# EasyEDA Pro project 3轴5.2_ -0718 -(8.8x13cm).eprj, board 3轴5.2-PCB-V3.4
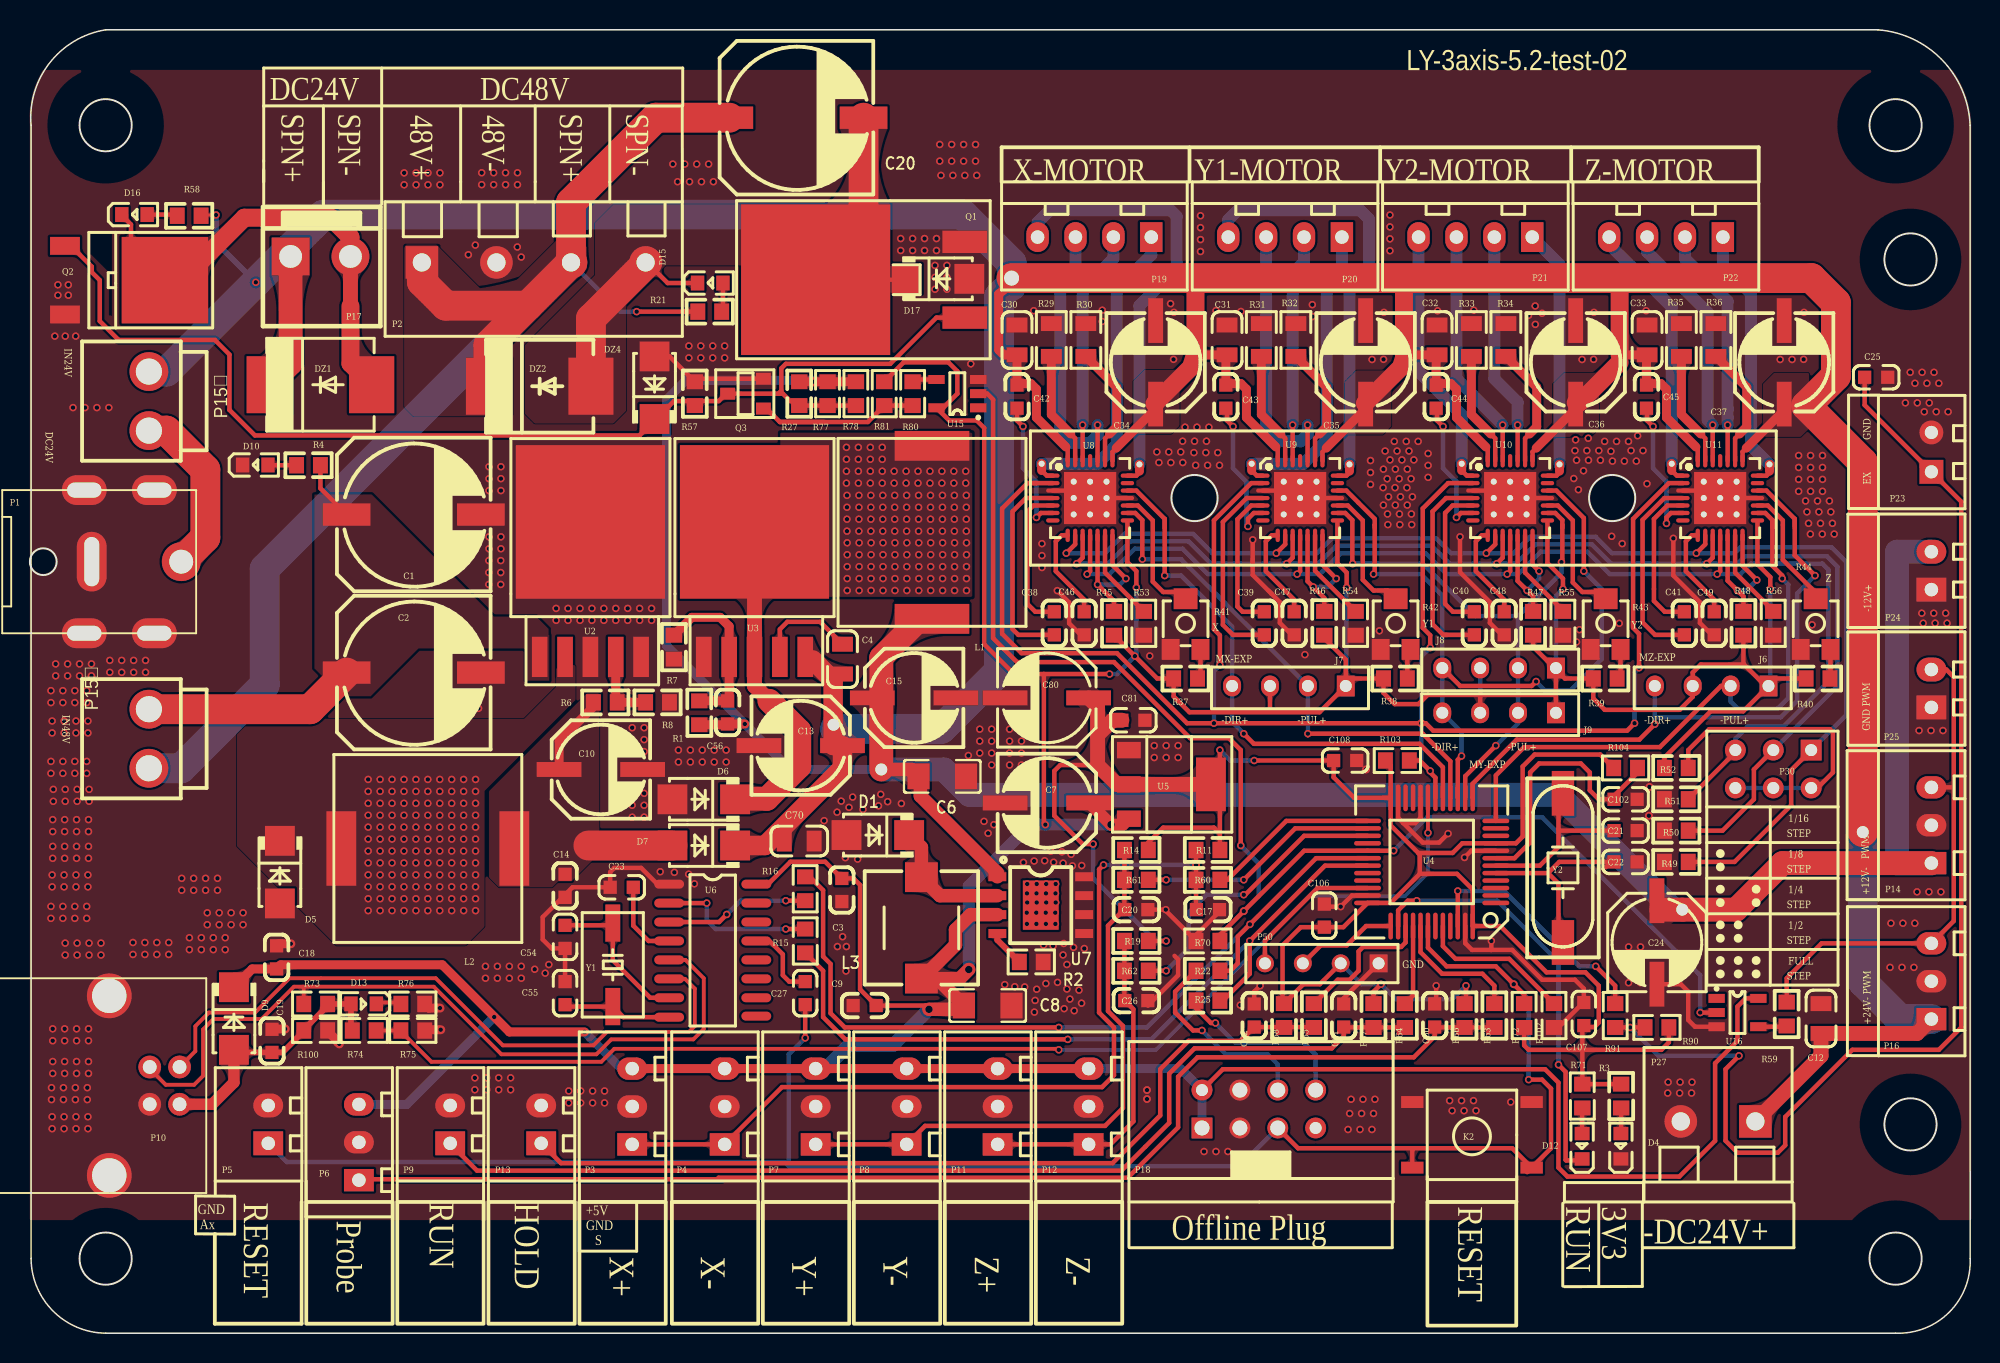
[diagram p2: board, top side]
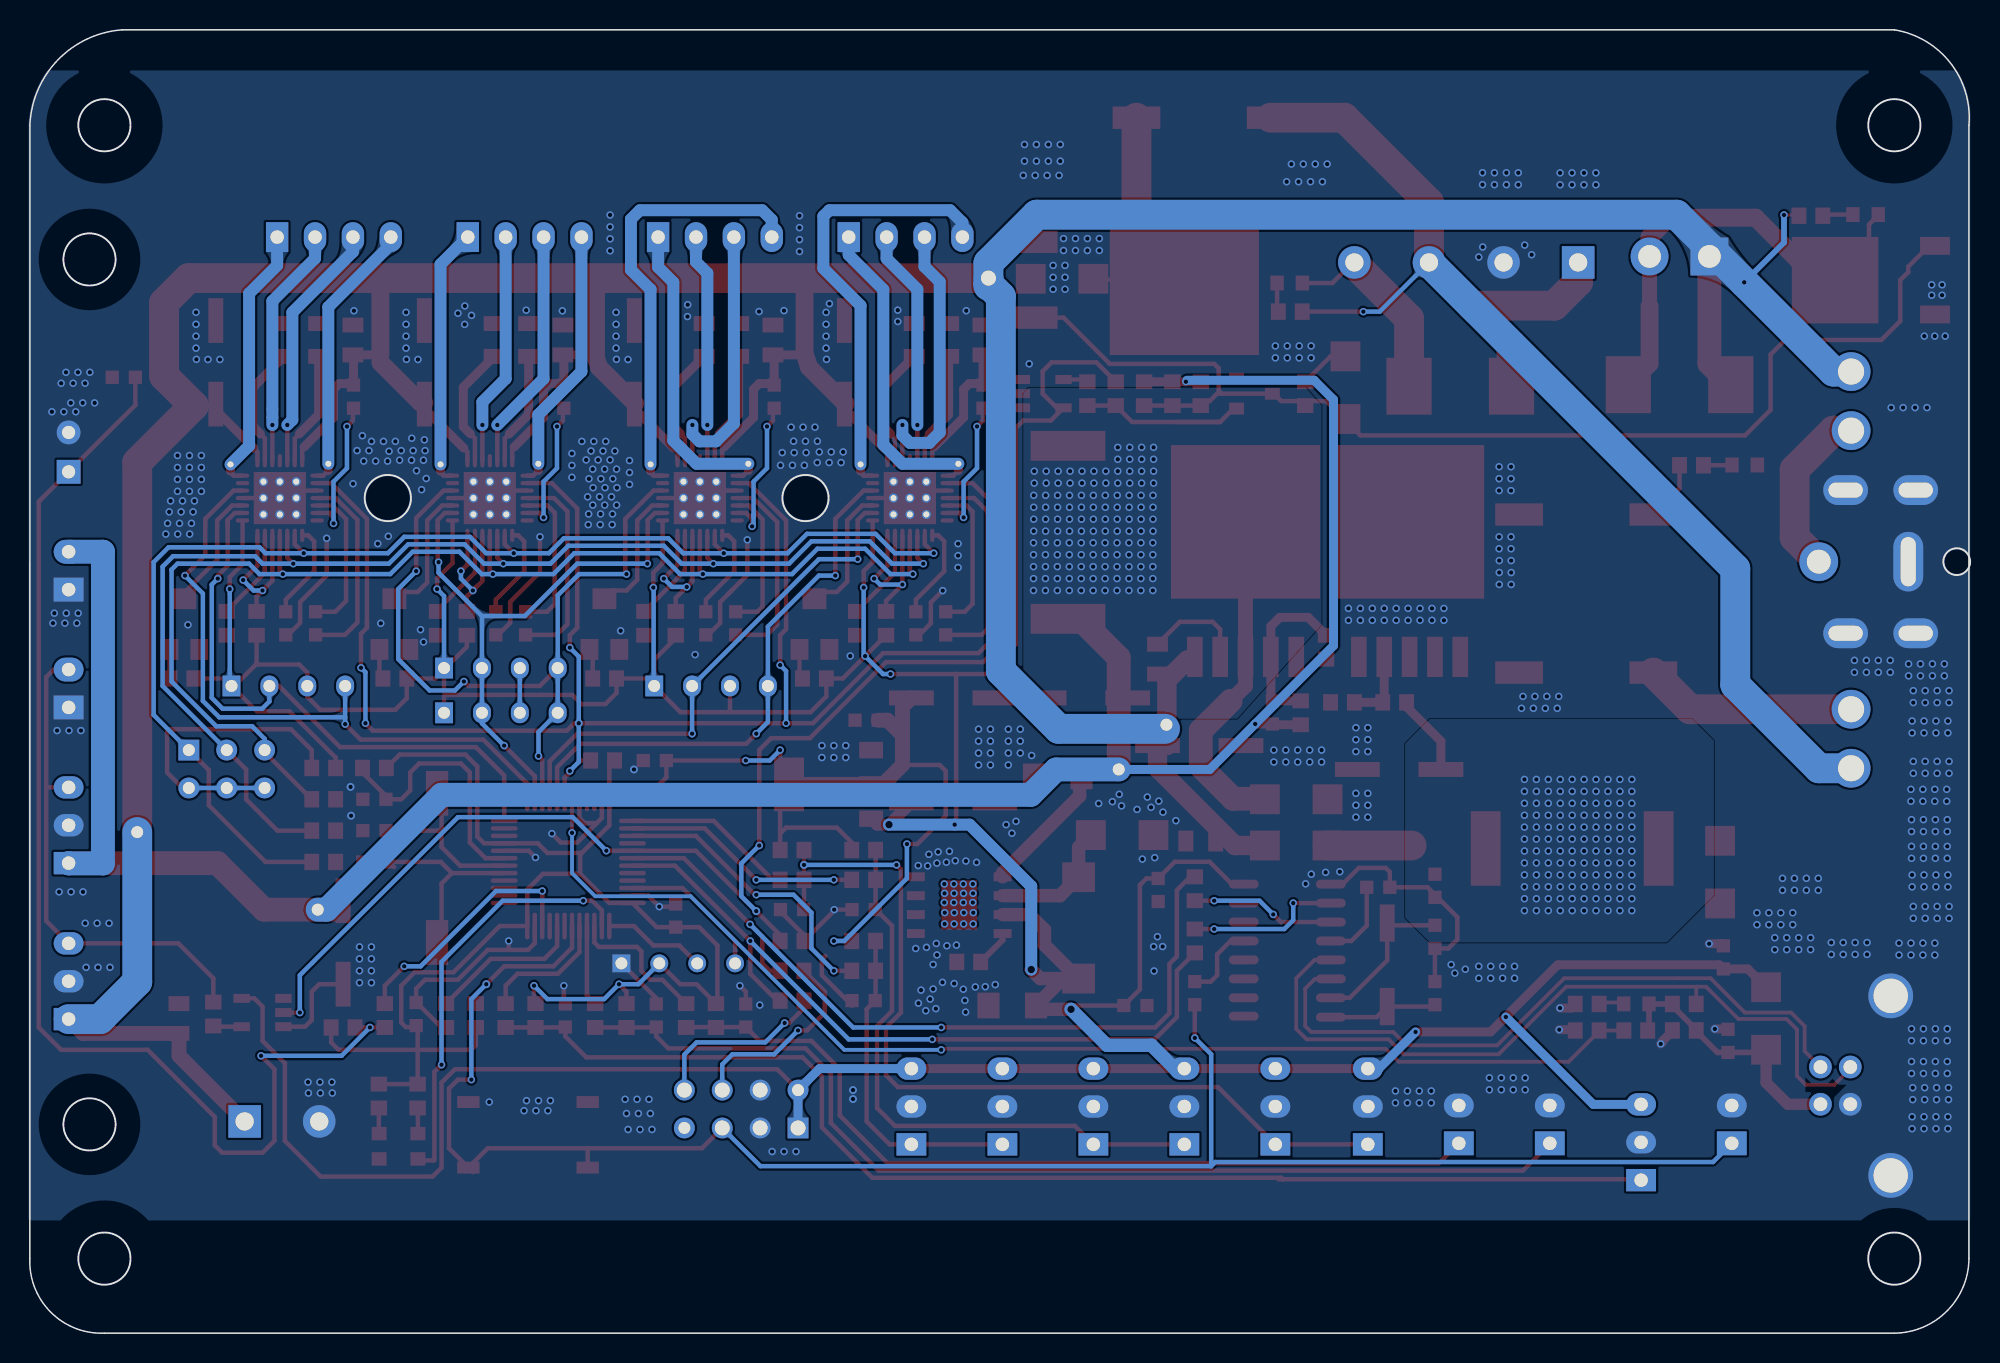
[diagram p3: board, bottom side, seen from below]

Outline 130.08 x 87.4 mm; copper layers: Top Layer, Bottom Layer. Coordinates in mm from the lower left corner of the outline.
Outline path: circle c5.08,81 r1.75 ; circle c5.08,5 r1.75 ; circle c78.08,56 r1.55 ; circle c106.08,56 r1.55 ; circle c125.08,81 r1.75 ; circle c125.08,5 r1.75 ; circle c126.08,72 r1.75 ; circle c126.08,14 r1.75 ; 0.08,81 0.08,5 arc(1.56,1.48) 5.08,0 125.08,0 arc(128.68,1.4) 130.08,5 130.08,81 arc(128.21,85.37) 123.9,87.4 5.08,87.4 arc(1.33,85.18) 0.08,81
Stack: Top Layer 0.0356mm / Dielectric1 0.32mm FR-4 er 4.8 / Bottom Layer 0.0356mm

## Design rules (mm)
net C24: Top Side Components
net R91: Top Side Components
net R90: Top Side Components
net P23: Top Side Components
net C25: Top Side Components
net R78: Top Side Components
net R77: Top Side Components
net D17: Top Side Components
net R56: Top Side Components
net R55: Top Side Components
net R54: Top Side Components
net R53: Top Side Components
net U16: Top Side Components
net U15: Top Side Components
net R104: Top Side Components
net R103: Top Side Components
net R102: Top Side Components
net R75: Top Side Components
net R74: Top Side Components
net R73: Top Side Components
net R72: Top Side Components
net R71: Top Side Components
net R70: Top Side Components
net P50: Top Side Components
net D4: Top Side Components
net C108: Top Side Components
net C107: Top Side Components
net C106: Top Side Components
net C22: Top Side Components
net C21: Top Side Components
net C102: Top Side Components
net C81: Top Side Components
net C80: Top Side Components
net C70: Top Side Components
net Y2: Top Side Components
net C52: Top Side Components
net C1: Top Side Components
net C2: Top Side Components
net C4: Top Side Components
net C5: Top Side Components
net C7: Top Side Components
net C9: Top Side Components
net C10: Top Side Components
net C12: Top Side Components
net C13: Top Side Components
net C14: Top Side Components
net C15: Top Side Components
net C16: Top Side Components
net C17: Top Side Components
net C18: Top Side Components
net C19: Top Side Components
net C20: Top Side Components
net C26: Top Side Components
net C30: Top Side Components
net C31: Top Side Components
net C32: Top Side Components
net C33: Top Side Components
net C34: Top Side Components
net C35: Top Side Components
net C36: Top Side Components
net C37: Top Side Components
net C38: Top Side Components
net C39: Top Side Components
net C40: Top Side Components
net C41: Top Side Components
net C42: Top Side Components
net C43: Top Side Components
net C44: Top Side Components
net C45: Top Side Components
net C46: Top Side Components
net C47: Top Side Components
net C48: Top Side Components
net C49: Top Side Components
net D5: Top Side Components
net D6: Top Side Components
net D7: Top Side Components
net D9: Top Side Components
net D10: Top Side Components
net D12: Top Side Components
net D13: Top Side Components
net D15: Top Side Components
net DZ1: Top Side Components
net DZ2: Top Side Components
net P24: Top Side Components
net P25: Top Side Components
net J6: Top Side Components
net J7: Top Side Components
net J8: Top Side Components
net K1: Top Side Components
net K2: Top Side Components
net L1: Top Side Components
net L2: Top Side Components
net P2: Top Side Components
net P3: Top Side Components
net P4: Top Side Components
net P5: Top Side Components
net P6: Top Side Components
net P7: Top Side Components
net P8: Top Side Components
net P9: Top Side Components
net P11: Top Side Components
net P12: Top Side Components
net P13: Top Side Components
net P14: Top Side Components
net P16: Top Side Components
net P17: Top Side Components
net P18: Top Side Components
net P19: Top Side Components
net P20: Top Side Components
net P21: Top Side Components
net P22: Top Side Components
net Q1: Top Side Components
net Q2: Top Side Components
net R1: Top Side Components
net R3: Top Side Components
net R4: Top Side Components
net R6: Top Side Components
net R7: Top Side Components
net R8: Top Side Components
net R11: Top Side Components
net R14: Top Side Components
net R19: Top Side Components
net R21: Top Side Components
net R22: Top Side Components
net R25: Top Side Components
net R27: Top Side Components
net R29: Top Side Components
net R30: Top Side Components
net R31: Top Side Components
net R32: Top Side Components
net R33: Top Side Components
net R34: Top Side Components
net R35: Top Side Components
net R36: Top Side Components
net R37: Top Side Components
net R38: Top Side Components
net R39: Top Side Components
net R40: Top Side Components
net R41: Top Side Components
net R42: Top Side Components
net R43: Top Side Components
net R44: Top Side Components
net R45: Top Side Components
net R46: Top Side Components
net R47: Top Side Components
net R48: Top Side Components
net R49: Top Side Components
net R50: Top Side Components
net R51: Top Side Components
net R52: Top Side Components
net U1: Top Side Components
net U2: Top Side Components
net U3: Top Side Components
net U4: Top Side Components
net U5: Top Side Components
net U8: Top Side Components
net U9: Top Side Components
net U10: Top Side Components
net U11: Top Side Components
net D16: Top Side Components
net DZ4: Top Side Components
net R57: Top Side Components
net R58: Top Side Components
net R59: Top Side Components
net J9: Top Side Components
net P27: Top Side Components
net C56: Top Side Components
net D11: Top Side Components
net P1: Top Side Components
net D18: Top Side Components
net C60: Top Side Components
net C61: Top Side Components
net C62: Top Side Components
net R60: Top Side Components
net R61: Top Side Components
net R62: Top Side Components
net R63: Top Side Components
net R64: Top Side Components
net R65: Top Side Components
net R66: Top Side Components
net R67: Top Side Components
net R68: Top Side Components
net P30: Top Side Components
net C23: Top Side Components
net C27: Top Side Components
net C54: Top Side Components
net C55: Top Side Components
net Q3: Top Side Components
net R15: Top Side Components
net R16: Top Side Components
net R80: Top Side Components
net R81: Top Side Components
net U6: Top Side Components
net Y1: Top Side Components
net R100: Top Side Components
net P10: Top Side Components
net P15: Top Side Components
net R76: Top Side Components
spacing Clearance (default): track to track 0.178, other pairs 0.178 to 0.178
spacing Polygon: track to track 0.508, other pairs 0.508 to 0.508
track width Width (default): min 0.01, default 0.254, max 5
differential pair DiffPairsRouting (default): width min 0.381, default 0.381, max 0.381; gap min 0.254, default 0.254
via RoutingVias (default): diameter min 0.3, default 0.8, max 1.27; hole min 0.3, default 0.6, max 2

## Placement (name value [footprint] x y rotation side)
C1  -  [电解电容贴片10x10]  25.48 54.8 0 top
C2  -  [电解电容贴片10x10]  25.48 44.2 0 top
C3  -  [0603C]  54.44 29.72 90 top
C4  -  [0805C]  54.48 45.2 270 top
C6  10uF  [C1206]  61.17 37.34 0 top
C7  100uF/35V  [电解电容贴片6X6]  68.19 35.56 180 top
C8  10uF  [C1206]  64.22 21.97 0 top
C9  -  [0603C]  55.97 21.97 0 top
C10  100uF/35V  [电解电容贴片6X6]  38.28 37.8 0 top
C12  105  [0805C]  120.08 21.1 90 top
C13  100uF/35V  [电解电容贴片6X6]  51.68 39.4 180 top
C14  104  [0603C]  35.88 30 90 top
C15  100uF/35V  [电解电容贴片6X6]  59.28 42.6 0 top
C17  104  [0603C]  78.98 28.4 180 top
C18  104  [0603C]  16.55 25.2 270 top
C19  104  [0603C]  16.23 19.6 270 top
C20  -  [电解电容贴片10x10]  51.14 81.41 0 top
C20#2  -  [0603C]  74.18 28.4 180 top
C21  22pF  [0603C]  106.98 33.7 0 top
C22  100pF  [0603C]  106.98 31.6 0 top
C23  100pF  [0603C]  39.68 29.9 180 top
C24  104  [电解电容贴片6x6]  109.08 26.2 270 top
C25  104  [0603C]  123.78 64.1 180 top
C26  104  [0603C]  74.18 22.3 180 top
C27  104  [0603C]  51.98 22.8 270 top
C30  105  [0805C]  66.18 66.6 90 top
C31  105  [0805C]  80.26 66.6 90 top
C32  105  [0805C]  94.34 66.6 90 top
C33  105  [0805C]  108.42 66.6 90 top
C34  47uF/50V  [电解电容贴片6X6]  75.48 65.1 90 top
C35  47uF/50V  [电解电容贴片6X6]  89.56 65.1 90 top
C36  47uF/50V  [电解电容贴片6X6]  103.64 65.1 90 top
C37  47uF/50V  [电解电容贴片6X6]  117.62 65.1 90 top
C38  104  [0603C]  68.68 47.6 90 top
C39  104  [0603C]  82.76 47.6 90 top
C40  104  [0603C]  96.84 47.6 90 top
C41  104  [0603C]  110.92 47.6 90 top
C42  104  [0603C]  66.18 62.8 90 top
C43  104  [0603C]  80.18 62.8 90 top
C44  104  [0603C]  94.28 62.8 90 top
C45  104  [0603C]  108.38 62.8 90 top
C46  -  [0603C]  70.68 47.6 270 top
C47  -  [0603C]  84.76 47.6 270 top
C48  224  [0603C]  98.84 47.6 270 top
C49  224  [0603C]  112.92 47.6 270 top
C54  33pF  [0603C]  35.88 26.57 270 top
C55  33pF  [0603C]  35.88 22.8 90 top
C56  33nF  [0603C]  46.78 41.63 270 top
C60  103  [0603C]  94.18 21.3 270 top
C61  103  [0603C]  88.08 21.3 270 top
C62  103  [0603C]  82.08 21.3 270 top
C70  105  [0805C]  51.58 33 0 top
C80  100uF/35V  [电解电容贴片6x6]  68.18 42.6 180 top
C81  104  [0603C]  73.98 41.1 180 top
C102  104  [0603C]  106.98 35.8 180 top
C106  104  [0603C]  86.78 28 270 top
C107  104  [0603C]  104.18 21.4 270 top
C108  104  [0603C]  88.18 38.4 180 top
D1  SS34  [SMA]  56.85 33.4 180 top
D4  红光  [0603LED]  106.68 12.5 270 top
D5  SS56  [SMA]  16.76 30.92 270 top
D6  -̹-  [SMA]  45.18 35.8 180 top
D7  SS56  [SMA]  45.18 32.7 180 top
D9  SS56  [SMA]  13.68 21.1 270 top
D10  红光  [0603LED]  15.08 58.2 180 top
D12  绿光  [0603LED]  104.08 12.5 270 top
D13  红光  [0603LED]  22.41 22.1 0 top
D15  绿光  [0603LED]  45.58 70.4 180 top
D16  绿光  [0603LED]  6.98 74.99 180 top
D17  SS56  [SMA]  60.88 70.7 0 top
DZ1  快恢复二极管RS2M  [SMC]  19.48 63.6 0 top
DZ2  快恢复二极管RS2M  [SMC]  34.18 63.5 0 top
DZ4  稳压二极管SMAZ10V  [SMA]  41.88 63.4 90 top
J6  4P  [SIP4]  116.56 43.4 180 top
J7  4P  [SIP4]  88.22 43.4 180 top
J8  4P  [SIP4]  102.31 44.6 180 top
J9  4P  [SIP4]  102.31 41.6 180 top
K2  按键  [按键6x6贴片]  96.68 13.3 270 top
L1  47uH/5A  [电感贴片12X12]  60.48 53.7 270 top
L2  47uH/5A  [电感贴片12X12]  26.68 32.5 0 top
L3  68uH  [IND-SMD_L7.0-W7.0_SMDRI74-330MT]  59.77 27.18 90 top
NOREF  -  [Pad_ie84]  99.24 57.1 0 top
NOREF#2  -  [Pad_ie91]  114.42 56 0 top
NOREF#3  -  [Pad_ie95]  113.32 57.1 0 top
NOREF#4  -  [Pad_ie68]  84.06 56 180 top
NOREF#5  -  [Pad_ie86]  95.99 58.3 0 top
NOREF#6  -  [Pad_ie73]  85.16 57.1 0 top
NOREF#7  -  [Pad_ie57]  72.18 57.1 0 top
NOREF#8  -  [Pad_ie81]  99.24 56 270 top
NOREF#9  -  [Pad_ie64]  69.98 54.9 180 top
NOREF#10  -  [Pad_ie70]  85.16 56 270 top
NOREF#11  -  [Pad_ie88]  114.42 54.9 0 top
NOREF#12  -  [Pad_ie67]  85.16 54.9 270 top
NOREF#13  -  [Pad_ie99]  57.08 37.8 0 top
NOREF#14  -  [Pad_ie89]  113.32 54.9 270 top
NOREF#15  -  [Pad_ie59]  71.08 56 270 top
NOREF#16  -  [Pad_ie58]  69.98 57.1 180 top
NOREF#17  -  [Pad_ie80]  100.34 56 0 top
NOREF#18  -  [Pad_ie71]  84.06 57.1 180 top
NOREF#19  -  [Pad_ie97]  110.07 58.3 0 top
NOREF#20  -  [Pad_ie83]  100.34 57.1 0 top
NOREF#21  -  [Pad_ie61]  69.98 56 180 top
NOREF#22  -  [Pad_ie69]  86.26 56 0 top
NOREF#23  -  [Pad_ie72]  86.26 57.1 0 top
NOREF#24  -  [Pad_ie78]  99.24 54.9 270 top
NOREF#25  -  [Pad_ie94]  114.42 57.1 0 top
NOREF#26  -  [Pad_ie56]  71.08 57.1 0 top
NOREF#27  -  [Pad_ie62]  71.08 54.9 270 top
NOREF#28  -  [Pad_ie66]  86.26 54.9 0 top
NOREF#29  -  [Pad_ie82]  98.14 57.1 180 top
NOREF#30  -  [Pad_ie96]  116.63 58.26 0 top
NOREF#31  -  [Pad_ie60]  72.18 56 0 top
NOREF#32  -  [Pad_ie54]  67.83 58.3 0 top
NOREF#33  -  [Pad_ie65]  84.06 54.9 180 top
NOREF#34  -  [Pad_ie85]  102.55 58.26 0 top
NOREF#35  -  [Pad_ie79]  98.14 56 180 top
NOREF#36  -  [Pad_ie55]  74.39 58.26 0 top
NOREF#37  -  [Pad_ie75]  81.91 58.3 0 top
NOREF#38  -  [Pad_ie76]  98.14 54.9 180 top
NOREF#39  -  [Pad_ie92]  113.32 56 270 top
NOREF#40  -  [Pad_ie102]  122.88 33.6 0 top
NOREF#41  -  [Pad_ie93]  112.22 57.1 180 top
NOREF#42  -  [Pad_ie53]  53.88 40.8 0 top
NOREF#43  -  [Pad_ie77]  100.34 54.9 0 top
NOREF#44  -  [Pad_ie90]  112.22 56 180 top
NOREF#45  -  [Pad_ie87]  112.22 54.9 180 top
NOREF#46  -  [Pad_ie74]  88.47 58.26 0 top
NOREF#47  -  [Pad_ie98]  65.82 70.75 0 top
NOREF#48  -  [Pad_ie63]  72.18 54.9 0 top
NOREF#49  -  [Pad_ie101]  110.78 28.4 0 top
P1  -  [DC007B]  -1.85 51.73 180 top
P2  KF300  [直插座4P-KF300]  26.28 71.8 0 top
P3  3P  [HDR1X3_CON]  40.38 15.2 90 top
P4  3P  [HDR1X3_CON]  46.58 15.2 90 top
P5  2P  [HDR1X2_CON]  15.98 14 90 top
P6  3P  [HDR1X3_CON]  22.06 12.8 90 top
P7  4P  [HDR1X3_CON]  52.68 15.2 90 top
P8  3P  [HDR1X3_CON]  58.78 15.2 90 top
P9  2P  [HDR1X2_CON]  28.18 14 90 top
P10  USB_TYPE-B  [USB_TYPEB]  7.68 16.6 270 top
P11  3P  [HDR1X3_CON]  64.88 15.2 90 top
P12  3P  [HDR1X3_CON]  70.98 15.2 90 top
P13  2P  [HDR1X2_CON]  34.28 14 90 top
P14  3P  [HDR1X3_CON]  127.48 34.06 90 top
P15  -  [2P-P3.96]  7.98 39.86 270 top
P15#2  -  [2P-P3.96]  7.98 62.5 270 top
P16  3P  [HDR1X3_CON]  127.48 23.6 90 top
P17  2P  [VH3.96-2P直插座]  19.63 73.04 180 top
P18  8P  [IDC8]  82.39 14.78 0 top
P19  4P  [HDR1X4_CON]  75.18 73.5 180 top
P20  4P  [HDR1X4_CON]  87.96 73.5 180 top
P21  4P  [HDR1X4_CON]  100.72 73.5 180 top
P22  4P  [HDR1X4_CON]  113.5 73.5 180 top
P23  2P  [HDR1X2_CON#2]  127.48 59.08 90 top
P24  2P红色  [HDR1X2_CON]  127.48 51.13 90 top
P25  2P  [HDR1X2_CON]  127.48 43.23 90 top
P27  KF300  [直插座2P-KF300]  115.68 14.2 180 top
P30  Header 3X2  [HDR2X3]  119.42 39.1 180 top
P50  -  [SIP4#2]  90.42 24.8 180 top
Q1  F540NS  [TO-263-2]  62.68 70.64 0 top
Q2  F50N06  [TO-252]  4.96 70.61 270 top
Q3  SS8050  [SOT-23]  47.98 63 90 top
R1  16K  [0603R]  44.88 41.6 270 top
R2  10K  [0603R]  67.14 24.89 0 top
R3  1K  [0603R]  106.68 15.9 270 top
R4  10K  [0603R]  18.68 58.2 0 top
R6  44.2K  [0603R]  38.58 42.3 180 top
R7  1.8K  [0603R]  43.18 46 90 top
R8  10K  [0603R]  42.08 42.3 180 top
R11  10K  [0603R]  78.98 32.4 0 top
R14  10K  [0603R]  74.18 32.4 0 top
R15  680!!  [0603R]  51.98 26.3 270 top
R16  10K  [0603R]  51.98 29.8 90 top
R19  10K  [0603R]  74.18 26.3 0 top
R21  1K  [0603R]  45.58 68.5 0 top
R22  100  [0603R]  78.98 24.3 180 top
R25  100  [0603R]  78.98 22.3 180 top
R27  1K  [0603R]  51.58 63 90 top
R29  0.1  [0805R]  68.48 66.6 90 top
R30  0.1  [0805R]  70.8 66.6 270 top
R31  0.1  [0805R]  82.56 66.6 90 top
R32  0.1  [0805R]  84.88 66.6 270 top
R33  0.1  [0805R]  96.64 66.6 90 top
R34  0.1  [0805R]  98.95 66.6 270 top
R35  0.1  [0805R]  110.72 66.6 90 top
R36  0.1  [0805R]  113.04 66.6 270 top
R37  20K  [0603R]  77.48 43.9 180 top
R38  20K  [0603R]  91.55 43.9 180 top
R39  -  [0603R]  105.62 43.9 180 top
R40  20K  [0603R]  119.88 43.9 180 top
R41  10K  [松下贴片电位器3x3]  77.48 47.6 0 top
R42  10K  [松下贴片电位器3x3]  91.56 47.6 0 top
R43  10K  [松下贴片电位器3x3]  105.64 47.6 0 top
R44  10K  [松下贴片电位器3x3]  119.72 47.6 0 top
R45  10K  [0603R]  72.68 47.6 90 top
R46  10K  [0603R]  86.78 47.6 90 top
R47  10K  [0603R]  100.78 47.6 90 top
R48  10K  [0603R]  114.88 47.6 90 top
R49  10K  [0603R]  110.38 31.6 180 top
R50  10K  [0603R]  110.38 33.7 180 top
R51  10K  [0603R]  110.38 35.8 180 top
R52  100  [0603R]  110.38 37.9 0 top
R53  0  [0603R]  74.68 47.6 90 top
R54  0  [0603R]  88.88 47.6 90 top
R55  -  [0603R]  102.78 47.6 90 top
R56  0  [0603R]  116.88 47.6 90 top
R57  10K  [0603R]  44.58 63 90 top
R58  10K  [0603R]  10.68 74.93 180 top
R59  100  [0603R]  117.78 21.4 90 top
R60  100  [0603R]  78.98 30.4 180 top
R61  100  [0603R]  74.18 30.4 180 top
R62  100  [0603R]  74.18 24.3 180 top
R63  100  [0603R]  98.18 21.3 270 top
R64  100  [0603R]  92.18 21.3 270 top
R65  100  [0603R]  86.08 21.3 270 top
R66  10K  [0603R]  96.18 21.3 90 top
R67  10K  [0603R]  90.08 21.3 90 top
R68  10K  [0603R]  84.08 21.3 90 top
R70  10K  [0603R]  78.98 26.3 0 top
R71  1K  [0603R]  104.08 15.9 90 top
R72  10K  [0603R]  100.18 21.3 90 top
R73  10K  [0603R]  19.16 22.07 180 top
R74  1K?  [0603R]  22.42 20.29 0 top
R75  1.8K  [0603R]  25.67 20.29 0 top
R76  1K  [0603R]  25.67 22.07 180 top
R77  1K  [0603R]  53.48 63 90 top
R78  1K  [0603R]  55.38 63 90 top
R80  100  [0603R]  59.18 63 270 top
R81  10K  [0603R]  57.28 63 90 top
R90  10K  [0603R]  109.08 20.5 0 top
R91  100  [0603R]  106.28 21.3 270 top
R100  1K!!  [0603R]  19.16 20.3 180 top
R102  10k  [0603R]  102.18 21.3 90 top
R103  -  [0603R]  91.68 38.4 180 top
R104  10k  [0603R]  106.98 37.9 0 top
U2  LM2576HVS-ADJ  [TO-263]  37.58 49.87 0 top
U3  XL4015  [TO-263]  48.58 49.87 0 top
U4  STM32F103C8T6/CBT6  [LQFP48]  93.98 31.6 180 top
U5  1117-3.3  [SOT-223]  76.38 36.8 270 top
U6  CH340G  [SOP16]  45.78 26.3 0 top
U7  XL1509-5.0E1//SXL1509-5.0E1  [ESOP-8_L4.9-W3.9-P1.27-LS6.0-BL-EP]  67.77 28.7 270 top
U8  HR4988SQ  [QFN28]  71.34 55.9 270 top
U9  HR4988SQ  [QFN28]  85.42 55.9 270 top
U10  HR4988SQ  [QFN28]  99.5 55.9 270 top
U11  HR4988SQ  [QFN28]  113.58 55.9 270 top
U15  74LVC1G04  [SOT-23-5]  62.18 63 180 top
U16  74LVC1G17  [SOT-23-5]  114.48 21.5 0 top
Y1  12M  [晶振贴片49SSMD]  39.08 24.7 90 top
Y2  8M  [晶振贴片]  102.78 31.2 90 top

## Footprints (pads in the part's own frame, mm; a bottom-side part is the same pattern mirrored in y, then rotated)
2P-P3.96
  round 2.6 hole 1.75: 1(-1.98,0) 2(1.98,0)
0603C
  rect 0.889x0.889 smd: 1(-0.774,0) 2(0.774,0)
0603LED
  rect 0.9x1 smd: 1(-0.884,-0.017) 2(0.816,-0.017)
0603R
  rect 1x1.1 smd: 1(-0.8,0) 2(0.8,0)
0805C
  rect 1x1.4 smd: 1(-1,0) 2(1,0)
0805R
  rect 1x1.4 smd: 1(-1.1,0) 2(1.1,0)
C1206
  rect 1.485x1.728 smd: 1(-1.593,0) 2(1.593,0)
DC007B
  round 2.6 hole 1.6: 1(-12,0)
  oval 2x4 hole 1x3.3: 2(-6,0)
  oval 3x2 hole 2.3x1: 3(-5.5,4.8) 4(-10.2,4.8) 5(-5.5,-4.8) 6(-10.2,-4.8)
ESOP-8_L4.9-W3.9-P1.27-LS6.0-BL-EP
  rect 0.6x1.2 smd: 1(-1.905,-2.909) 2(-0.635,-2.909) 3(0.635,-2.909) 4(1.905,-2.909) 5(1.905,2.909) 6(0.635,2.909) 7(-0.635,2.909) 8(-1.905,2.909)
  rect 3.3x2.4 smd: 9(0,0)
HDR1X2_CON
  rect 1.6x2 hole 0.9: 1(-1.27,0)
  oval 1.6x2 hole 0.9: 2(1.27,0)
HDR1X2_CON#2
  rect 1.6x1.6 hole 0.88: 1(-1.32,0)
  round 1.6 hole 0.88: 2(1.32,0)
HDR1X3_CON
  rect 1.5x2 hole 0.9: 1(-2.54,0)
  oval 1.5x2 hole 0.9: 2(0,0) 3(2.54,0)
HDR1X4_CON
  rect 1.5x2 hole 0.9: 1(0,0)
  oval 1.5x2 hole 0.9: 2(2.54,0) 3(5.08,0) 4(7.62,0)
HDR2X3
  rect 1.4x1.4 hole 0.8: 1(0,0)
  round 1.4 hole 0.8: 2(0,2.54) 3(2.54,0) 4(2.54,2.54) 5(5.08,0) 6(5.08,2.54)
IDC8
  rect 1.4x1.4 hole 1: 1(-3.812,-1.019)
  round 1.4 hole 0.8: 2(-3.812,1.521) 7(3.808,-1.019)
  round 1.4 hole 1: 3(-1.272,-1.019) 4(-1.272,1.521) 5(1.268,-1.019) 6(1.268,1.521) 8(3.808,1.521)
IND-SMD_L7.0-W7.0_SMDRI74-330MT
  rect 2x2.2 smd: 1(-3.4,0) 2(3.4,0)
LQFP48
  oval 1.8x0.3 smd: 1(-4.3,2.75) 2(-4.3,2.25) 3(-4.3,1.75) 4(-4.3,1.25) 5(-4.3,0.75) 6(-4.3,0.25) 7(-4.3,-0.25) 8(-4.3,-0.75) 9(-4.3,-1.25) 10(-4.3,-1.75) 11(-4.3,-2.25) 12(-4.3,-2.75) 25(4.3,-2.75) 26(4.3,-2.25) 27(4.3,-1.75) 28(4.3,-1.25) 29(4.3,-0.75) 30(4.3,-0.25) 31(4.3,0.25) 32(4.3,0.75) 33(4.3,1.25) 34(4.3,1.75) 35(4.3,2.25) 36(4.3,2.75)
  oval 0.3x1.8 smd: 13(-2.75,-4.3) 14(-2.25,-4.3) 15(-1.75,-4.3) 16(-1.25,-4.3) 17(-0.75,-4.3) 18(-0.25,-4.3) 19(0.25,-4.3) 20(0.75,-4.3) 21(1.25,-4.3) 22(1.75,-4.3) 23(2.25,-4.3) 24(2.75,-4.3) 37(2.75,4.3) 38(2.25,4.3) 39(1.75,4.3) 40(1.25,4.3) 41(0.75,4.3) 42(0.25,4.3) 43(-0.25,4.3) 44(-0.75,4.3) 45(-1.25,4.3) 46(-1.75,4.3) 47(-2.25,4.3) 48(-2.75,4.3)
Pad_ie53
  round 1.2 hole 0.8: 1(0,0)
Pad_ie54
  round 0.6 hole 0.4: 0(0,0)
Pad_ie55
  round 0.6 hole 0.4: 3(0,0)
Pad_ie56
  round 0.6 hole 0.4: 4(0,0)
Pad_ie57
  round 0.6 hole 0.4: 5(0,0)
Pad_ie58
  round 0.6 hole 0.4: 5(0,0)
Pad_ie59
  round 0.6 hole 0.4: 5(0,0)
Pad_ie60
  round 0.6 hole 0.4: 5(0,0)
Pad_ie61
  round 0.6 hole 0.4: 5(0,0)
Pad_ie62
  round 0.6 hole 0.4: 5(0,0)
Pad_ie63
  round 0.6 hole 0.4: 5(0,0)
Pad_ie64
  round 0.6 hole 0.4: 5(0,0)
Pad_ie65
  round 0.6 hole 0.4: 5(0,0)
Pad_ie66
  round 0.6 hole 0.4: 5(0,0)
Pad_ie67
  round 0.6 hole 0.4: 5(0,0)
Pad_ie68
  round 0.6 hole 0.4: 5(0,0)
Pad_ie69
  round 0.6 hole 0.4: 5(0,0)
Pad_ie70
  round 0.6 hole 0.4: 5(0,0)
Pad_ie71
  round 0.6 hole 0.4: 5(0,0)
Pad_ie72
  round 0.6 hole 0.4: 5(0,0)
Pad_ie73
  round 0.6 hole 0.4: 4(0,0)
Pad_ie74
  round 0.6 hole 0.4: 3(0,0)
Pad_ie75
  round 0.6 hole 0.4: 0(0,0)
Pad_ie76
  round 0.6 hole 0.4: 5(0,0)
Pad_ie77
  round 0.6 hole 0.4: 5(0,0)
Pad_ie78
  round 0.6 hole 0.4: 5(0,0)
Pad_ie79
  round 0.6 hole 0.4: 5(0,0)
Pad_ie80
  round 0.6 hole 0.4: 5(0,0)
Pad_ie81
  round 0.6 hole 0.4: 5(0,0)
Pad_ie82
  round 0.6 hole 0.4: 5(0,0)
Pad_ie83
  round 0.6 hole 0.4: 5(0,0)
Pad_ie84
  round 0.6 hole 0.4: 4(0,0)
Pad_ie85
  round 0.6 hole 0.4: 3(0,0)
Pad_ie86
  round 0.6 hole 0.4: 0(0,0)
Pad_ie87
  round 0.6 hole 0.4: 5(0,0)
Pad_ie88
  round 0.6 hole 0.4: 5(0,0)
Pad_ie89
  round 0.6 hole 0.4: 5(0,0)
Pad_ie90
  round 0.6 hole 0.4: 5(0,0)
Pad_ie91
  round 0.6 hole 0.4: 5(0,0)
Pad_ie92
  round 0.6 hole 0.4: 5(0,0)
Pad_ie93
  round 0.6 hole 0.4: 5(0,0)
Pad_ie94
  round 0.6 hole 0.4: 5(0,0)
Pad_ie95
  round 0.6 hole 0.4: 4(0,0)
Pad_ie96
  round 0.6 hole 0.4: 3(0,0)
Pad_ie97
  round 0.6 hole 0.4: 0(0,0)
Pad_ie98
  round 1.6 hole 1: 0(0,0)
Pad_ie99
  round 1.2 hole 0.8: 1(0,0)
Pad_ie101
  round 1.2 hole 0.8: 1(0,0)
Pad_ie102
  round 1.2 hole 0.8: 1(0,0)
QFN28
  oval 0.28x0.895 smd: 1(-1.601,-2.756) 2(-1.101,-2.756) 3(-0.601,-2.756) 4(-0.1,-2.756) 5(0.401,-2.756) 6(0.9,-2.756) 7(1.401,-2.756) 15(1.401,2.244) 16(0.9,2.244) 17(0.401,2.244) 18(-0.1,2.244) 19(-0.601,2.244) 20(-1.101,2.244) 21(-1.601,2.244)
  oval 0.895x0.28 smd: 8(2.4,-1.758) 9(2.4,-1.257) 10(2.4,-0.756) 11(2.4,-0.256) 12(2.4,0.244) 13(2.4,0.745) 14(2.4,1.245) 22(-2.6,1.245) 23(-2.6,0.745) 24(-2.6,0.244) 25(-2.6,-0.256) 26(-2.6,-0.756) 27(-2.6,-1.257) 28(-2.6,-1.758)
  rect 3.5x3.5 smd: 29(-0.1,-0.256)
SIP4
  rect 1.2x1.4 hole 0.8: 1(0,0)
  oval 1.2x1.4 hole 0.8: 2(2.54,0) 3(5.08,0) 4(7.62,0)
SIP4#2
  rect 1.2x1.2 hole 0.8: 1(0,0)
  round 1.2 hole 0.8: 2(2.54,0) 3(5.08,0) 4(7.62,0)
SMA
  rect 2x2 smd: 1(2.1,0) 2(-2.1,0)
SMC
  rect 3.03x3.82 smd: 1(3.435,0) 2(-3.435,0)
SOP16
  oval 2x0.6 smd: 1(-2.921,3.81) 2(-2.921,2.54) 3(-2.921,1.27) 4(-2.921,0) 5(-2.921,-1.27) 6(-2.921,-2.54) 7(-2.921,-3.81) 8(-2.921,-5.11) 9(2.921,-5.04) 10(2.921,-3.81) 11(2.921,-2.54) 12(2.921,-1.27) 13(2.921,0) 14(2.921,1.27) 15(2.921,2.54) 16(2.921,3.81)
SOT-23
  rect 0.8x1 smd: 1(-1,-1.2) 2(0,1.2) 3(1,-1.2)
SOT-23-5
  rect 1.1x0.6 smd: 1(-1.4,0.95) 2(-1.4,0) 3(-1.4,-0.95) 4(1.4,-0.95) 5(1.4,0.95)
SOT-223
  rect 1.1x1.6 smd: 1(-2.3,-2.7) 2(0,-2.7) 3(2.3,-2.7)
  rect 3.6x2 smd: 4(0,2.8)
TO-252
  rect 1.2x2 smd: 1(-2.3,-2.6) 3(2.3,-2.6)
  rect 5.8x5.8 smd: 2(0,4.1)
TO-263
  rect 1.05x2.7 smd: 1(-3.4,-4.526) 2(-1.7,-4.526) 3(0,-4.526) 4(1.7,-4.526) 5(3.4,-4.526)
  rect 10x10.3 smd: 3(0,4.526)
TO-263-2
  rect 3x1.5 smd: 1(0,-2.54) 3(0,2.54)
  rect 10x10.1 smd: 2(-10,0)
USB_TYPEB
  round 1.524 hole 0.92: 1(1.25,2.355) 2(-1.25,2.355) 3(-1.25,0.355) 4(1.25,0.355)
  round 3 hole 2.3: 5(-6.02,-2.355) 6(6.02,-2.355)
VH3.96-2P直插座
  rect 2.54x2.54 hole 1.524: 1(2.151,0.84)
  round 2.54 hole 1.524: 2(-1.863,0.84)
按键6x6贴片
  rect 0.8x1.5 smd: 1(2.2,4) 2(-2.2,4) 3(2.2,-4) 4(-2.2,-4)
晶振贴片
  rect 3x1.5 smd: 1(-5,0) 2(5,0)
晶振贴片49SSMD
  rect 2.5x1 smd: 1(-2.8,0) 2(2.8,0)
松下贴片电位器3x3
  rect 1.2x1.4 smd: 1(-1,-1.75) 3(1,-1.75)
  rect 1.6x1.4 smd: 2(0,1.65)
电感贴片12X12
  rect 2x5 smd: 1(-5.8,0) 2(5.8,0)
电解电容贴片6X6
  rect 3x1 smd: 1(-2.8,0) 2(2.8,0)
电解电容贴片6x6
  rect 3x1 smd: 1(-2.8,0) 2(2.8,0)
电解电容贴片10x10
  rect 3.2x1.5 smd: 1(-4.242,0.097) 2(4.758,0.097)
直插座2P-KF300
  rect 2.184x2.184 hole 1.219: 1(0,0)
  round 2.184 hole 1.219: 2(5,0)
直插座4P-KF300
  rect 2.184x2.184 hole 1.219: 1(0,0)
  round 2.184 hole 1.219: 2(5,0) 3(10,0) 4(15,0)

## Nets
3V3: C80.1 C81.2 C106.2 C107.2 C108.2 P50.2 R3.1 R11.2 R14.2 R19.2 R66.2 R67.2 R68.2 R71.2 R72.1 R90.2 R103.2 R104.1 U4.9 U4.24 U4.36 U4.48 U5.2 U5.4
12V: C6.1 C15.1 C24.1 C56.2 L1.2 NOREF#13.1 NOREF#49.1 P14.1 P24.2 R1.2 R27.2 R77.2 R78.2 U7.1
24V: C4.2 C12.1 C13.1 C30.1 C31.1 C32.1 C33.1 C34.1 C35.1 C36.1 C37.1 C42.2 C43.2 C44.2 C45.2 C70.1 D7.2 DZ1.2 NOREF#40.1 NOREF#42.1 NOREF#47.0 P15#2.1 P16.1 P17.1 P27.1 R58.1 U3.5 U8.22 U8.28 U9.22 U9.28 U10.22 U10.28 U11.22 U11.28
48V1: C1.1 C2.1 P15.1 R4.2 U2.1
48V_IN: C20.1 DZ2.2 P2.1 P2.3 P15.2 R21.1
48V_SPN-: C20.2 D15.2 D17.2 DZ2.1 P2.4 Q1.2
GND: C1.2 C2.2 C3.1 C6.2 C7.2 C8.2 C9.1 C10.2 C12.2 C13.2 C14.1 C15.2 C17.1 C18.1 C19.1 C20#2.1 C21.2 C22.2 C23.2 C24.2 C25.1 C26.1 C30.2 C31.2 C32.2 C33.2 C34.2 C35.2 C36.2 C37.2 C46.2 C47.2 C48.2 C49.2 C54.2 C55.2 C60.1 C61.1 C62.1 C70.2 C80.2 C81.1 C102.1 C106.1 C107.1 C108.1 D1.1 D4.2 D5.1 D6.1 D10.2 D17.1 DZ4.1 K2.2 K2.4 NOREF.4 NOREF#2.5 NOREF#3.4 NOREF#4.5 NOREF#6.4 NOREF#7.5 NOREF#8.5 NOREF#9.5 NOREF#10.5 NOREF#11.5 NOREF#12.5 NOREF#14.5 NOREF#15.5 NOREF#16.5 NOREF#17.5 NOREF#18.5 NOREF#20.5 NOREF#21.5 NOREF#22.5 NOREF#23.5 NOREF#24.5 NOREF#25.5 NOREF#26.4 NOREF#27.5 NOREF#28.5 NOREF#29.5 NOREF#31.5 NOREF#33.5 NOREF#35.5 NOREF#38.5 NOREF#39.5 NOREF#41.5 NOREF#43.5 NOREF#44.5 NOREF#45.5 NOREF#48.5 P1.2 P1.3 P1.4 P1.5 P1.6 P2.2 P3.2 P4.2 P5.2 P6.2 P7.2 P8.2 P9.2 P10.4 P10.5 P10.6 P11.2 P12.2 P13.2 P14.2 P16.2 P18.3 P18.4 P23.2 P24.1 P25.1 P27.2 P50.1 Q1.3 Q2.3 Q3.3 R2.2 R7.1 R8.1 R29.2 R30.1 R31.2 R32.1 R33.2 R34.1 R35.2 R36.1 R41.1 R42.1 R43.1 R44.1 R49.2 R50.2 R51.2 R53.1 R54.1 R55.1 R56.1 R57.2 R70.1 R75.2 R76.1 R100.1 R102.1 U2.3 U2.5 U3.1 U4.8 U4.20 U4.23 U4.35 U4.47 U5.1 U6.1 U7.5 U7.6 U7.7 U7.8 U8.3 U8.18 U8.29 U9.3 U9.18 U9.29 U10.3 U10.18 U10.29 U11.3 U11.18 U11.29 U15.3 U16.3
VCC: C3.2 C7.1 C8.1 C9.2 C18.2 D9.2 J6.1 J6.3 J7.1 J7.3 J8.1 J8.3 J9.1 J9.3 L3.1 P3.3 P4.3 P6.3 P7.3 P8.3 P11.3 P12.3 P18.1 P18.2 R37.2 R38.2 R39.2 R40.2 R45.1 R46.1 R47.1 R48.1 R52.1 R81.2 U5.3 U6.16 U7.3 U8.15 U9.15 U10.15 U11.15 U15.5 U16.5
A_LIMT: U4.28
BOOT0: R102.2 U4.44
EXIO: R91.1 U4.46
HOLD: R65.1 U4.39
IN24V: P1.1 P15#2.2
MA_DIR: U4.11
MA_STEP: U4.10
MOTOR_EN: R103.1 U4.18 U8.2 U9.2 U10.2 U11.2
MS1: P30.1 R49.1 U8.9 U9.9 U10.9 U11.9
MS2: P30.3 R50.1 U8.10 U9.10 U10.10 U11.10
MS3: P30.5 R51.1 U8.11 U9.11 U10.11 U11.11
MX_1A: P19.3 U8.24
MX_1B: NOREF#36.3 P19.4 U8.21
MX_2A: P19.2 U8.26
MX_2B: NOREF#32.0 P19.1 U8.1
MX_DIR: J7.4 U4.17 U8.19
MX_STEP: J7.2 U4.16 U8.16
MY1_1A: P20.3 U9.24
MY1_1B: NOREF#46.3 P20.4 U9.21
MY1_2A: P20.2 U9.26
MY1_2B: NOREF#37.0 P20.1 U9.1
MY2_1A: P21.2 U10.24
MY2_1B: NOREF#34.3 P21.1 U10.21
MY2_2A: P21.3 U10.26
MY2_2B: NOREF#5.0 P21.4 U10.1
MY_DIR: J8.4 J9.4 U4.15 U9.19 U10.19
MY_STEP: J8.2 J9.2 U4.14 U9.16 U10.16
MZ_1A: P22.2 U11.24
MZ_1B: NOREF#30.3 P22.1 U11.21
MZ_2A: P22.3 U11.26
MZ_2B: NOREF#19.0 P22.4 U11.1
MZ_DIR: J6.4 U4.13 U11.19
MZ_STEP: J6.2 U4.12 U11.16
NETC4_1: C4.1 U3.4
NETC10_1: C10.1 C14.2 D7.1 L2.2 R6.2
NETC17_2: C17.2 P3.1 P4.1 R11.1 R60.2
NETC20_2: C20#2.2 P7.1 P8.1 R14.1 R61.2
NETC23_1: C23.1 U6.4
NETC25_2: C25.2 P23.1 R90.1 R91.2
NETC26_2: C26.2 P11.1 P12.1 R19.1 R62.2
NETC27_1: C27.1 U6.13
NETC38_1: C38.1 U8.4
NETC38_2: C38.2 U8.5
NETC39_1: C39.1 U9.4
NETC39_2: C39.2 U9.5
NETC40_1: C40.1 U10.4
NETC40_2: C40.2 U10.5
NETC41_1: C41.1 U11.4
NETC41_2: C41.2 U11.5
NETC42_1: C42.1 U8.6
NETC43_1: C43.1 U9.6
NETC44_1: C44.1 U10.6
NETC45_1: C45.1 U11.6
NETC46_1: C46.1 U8.8
NETC47_1: C47.1 U9.8
NETC48_1: C48.1 U10.8
NETC49_1: C49.1 U11.8
NETC54_1: C54.1 U6.7 Y1.2
NETC55_1: C55.1 U6.8 Y1.1
NETC56_1: C56.1 R1.1 R7.2 U3.2
NETC60_2: C60.2 P6.1 R63.2 R66.1
NETC61_2: C61.2 P9.1 R64.2 R67.1
NETC62_2: C62.2 P13.1 R65.2 R68.1
NETD4_1: D4.1 R3.2
NETD5_2: D5.2 L2.1 U2.2
NETD6_2: D6.2 L1.1 U3.3
NETD10_1: D10.1 R4.1
NETD12_1: D12.1 R71.1
NETD12_2: D12.2 U4.38
NETD13_2: D13.2 R76.2
NETD15_1: D15.1 R21.2
NETD16_1: D16.1 R58.2
NETD16_2: D16.2 DZ1.1 P17.2 Q2.2
NETDZ4_2: DZ4.2 Q1.1 Q2.1 Q3.2 R27.1 R57.1 R77.1 R78.1
NETP18_6: P18.6 R22.2
NETP18_8: P18.8 R25.2
NETP30_2: P30.2 P30.4 P30.6 R52.2
NETQ3_1: Q3.1 R80.2 R81.1
NETR6_1: R6.1 R8.2 U2.4
NETR15_1: R15.1 U6.2
NETR16_1: R16.1 U6.3
NETR29_1: R29.1 U8.27
NETR30_2: R30.2 U8.23
NETR31_1: R31.1 U9.27
NETR32_2: R32.2 U9.23
NETR33_1: R33.1 U10.27
NETR34_2: R34.2 U10.23
NETR35_1: R35.1 U11.27
NETR36_2: R36.2 U11.23
NETR37_1: R37.1 R41.3
NETR38_1: R38.1 R42.3
NETR39_1: R39.1 R43.3
NETR40_1: R40.1 R44.3
NETR41_2: R41.2 U8.17
NETR42_2: R42.2 U9.17
NETR43_2: R43.2 U10.17
NETR44_2: R44.2 U11.17
NETR45_2: R45.2 U8.12 U8.14
NETR46_2: R46.2 U9.12 U9.14
NETR47_2: R47.2 U10.12 U10.14
NETR48_2: R48.2 U11.12 U11.14
NETR53_2: R53.2 U8.13
NETR54_2: R54.2 U9.13
NETR55_2: R55.2 U10.13
NETR56_2: R56.2 U11.13
NETR59_1: R59.1 U16.4
NETR80_1: R80.1 U15.4
NRST: C102.2 R104.2 U4.7
PROBE: R63.1 U4.41
PWM: P14.3 P16.3 P25.2 R59.2
RST: C27.2 K2.1 K2.3 P5.1 P18.5 R72.2 U4.42
RUN: R64.1 U4.40
RXD: R15.2 R25.1 U4.31
SPINDLE_PWM: R70.2 U4.29 U15.2 U16.2
SWCLK: P50.3 U4.37
SWDIO: P50.4 U4.34
TXD: R16.2 R22.1 U4.30
USB-CHK: R74.2 R75.1 U4.19
USB_DM: P10.2 U6.6
USB_DP: P10.3 R73.2 U6.5
VUSB: C19.2 D9.1 D13.1 P10.1 R73.1 R74.1 R100.2
X_LIMT: R60.1 U4.25
XTAL1: C22.1 U4.5 Y2.1
XTAL2: C21.1 U4.6 Y2.2
Y_LIMT: R61.1 U4.26
Z_LIMT: R62.1 U4.27
$9N72390: D1.2 L3.2 U7.2
$9N72392: R2.1 U7.4

Pads without a net: P18 7; U4 1 2 3 4 21 22 32 33 43 45; U6 9 10 11 12 14 15; U7 9; U8 7 20 25; U9 7 20 25; U10 7 20 25; U11 7 20 25; U15 1; U16 1

## Via types
v1: diameter 0.5, hole 0.3, Top Layer to Bottom Layer, 1005 vias
v2: diameter 0.53, hole 0.3, Top Layer to Bottom Layer, 9 vias
v3: diameter 0.8, hole 0.5, Top Layer to Bottom Layer, 3 vias

## Routing (per net, layer and track width the routed paths; a pad name or vN(x,y) marks a point on that pad's centre or on a via; arc(x,y) is an arc through that point)
3V3: length 159.6
  Top Layer w0.3: P50.2 86.48,23.4 85.38,23.4 R68.2 83.98,22.2 83.98,26 85.21,27.23 C106.2 88.06,27.23 U4.36 91.23,28.85 93.18,30.8 ; U4.24 91.23,38.05 R103.2 ; U4.24 88.78,35.9 87.41,37.27 C108.2 v1(82.08,38.4) ; U4.24 91.23,34.05 93.08,32.2 ; 103.98,19 100.48,19 100.18,19.3 R72.1 ; 104.08,19 R71.2 R3.1 ; 104.08,19 104.08,20.33 104.28,20.53 104.88,20.53 105.18,20.83 105.18,23.3 104.28,24.2 101.68,24.2 98.58,27.3 U4.48 96.73,29.75 95.68,30.8 93.18,30.8 ; 104.08,19 109.38,19 109.88,19.5 R90.2 ; 93.18,30.8 93.18,32.1 93.08,32.2 ; 93.08,32.2 95.38,32.2 96.03,32.85 U4.9 99.63,32.85 100.08,33.3 100.08,38 100.88,38.8 105.28,38.8 R104.1 ; R19.2 v1(76.18,26.3) ; v1(90.58,23.4) 90.08,22.9 R67.2 ; 79.78,33.5 79.78,36.2 U5.4 79.78,37.4 v1(79.78,39.1) ; 79.78,33.5 79.38,33.9 75.98,33.9 74.98,32.9 R14.2 ; 79.78,33.5 R11.2 ; v1(71.28,32.8) 70.58,32.8 68.68,34.7 68.68,37.7 69.08,38.1 71.58,38.1 ; 96.28,22.2 v1(96.28,23.3)
  Top Layer w1: 71.58,40.1 71.58,38.1 72.88,36.8 U5.2 U5.4 ; 71.58,40.1 71.58,42 C80.1 ; 71.58,40.1 72.58,41.1 C81.2
  Bottom Layer w0.3: v1(96.28,23.3) 95.38,22.4 91.58,22.4 v1(90.58,23.4) 89.28,23.4 P50.2 ; v1(76.18,26.3) 75.48,26.3 71.28,30.5 v1(71.28,32.8) ; v1(79.78,39.1) 80.48,38.4 v1(82.08,38.4)
12V: length 178.1
  Top Layer w0.6: 51.48,63.9 R27.2 v1(52.58,63.8) R77.2 R78.2 ; v1(47.93,40.85) 46.78,40.85 46.73,40.8 R1.2
  Top Layer w0.9: NOREF#13.1 59.11,37.8 59.7,37.21 59.7,36.02 64.86,30.86 U7.1
  Top Layer w1.6: 109.38,28.4 NOREF#49.1 114.38,28.4 117.5,31.52 P14.1 ; 60.78,47.8 59.58,47.8 57.08,45.3 NOREF#13.1
  Bottom Layer w0.6: NOREF#13.1 50.98,37.8 v1(47.93,40.85) 42.68,46.1 42.68,62.6 43.98,63.9 52.51,63.9
  Bottom Layer w1.6: P14.1 127.46,31.5 125.18,31.5 125.18,52.4 P24.2 ; NOREF#49.1 110.18,28.4 102.48,36.1 62.98,36.1 61.28,37.8 NOREF#13.1
24V: length 357.8
  Top Layer w0.203: 11.96,74.98 v1(12.48,74.98)
  Top Layer w0.3: 97.74,58.5 97.74,59.3 ; 86.66,58.5 86.66,59.1 86.86,59.3 ; U10.22 100.74,59.1 100.94,59.3 ; 115.02,59.3 114.82,59.1 U11.22 ; 69.58,58.5 69.58,59.3 ; 72.78,59.3 72.58,59.1 U8.22 ; 83.66,58.5 83.66,59.3 ; 111.82,58.5 111.82,59.3
  Top Layer w0.6: 80.26,63.67 81.19,63.67 81.56,63.3 81.56,61.4 83.53,59.43 ; 92.12,65.6 C32.1 94.28,65.54 C44.2 ; 94.34,63.67 95.27,63.67 95.64,63.3 95.64,61.4 97.61,59.43 ; C45.2 108.38,65.56 C33.1 106.58,65.6 ; 111.69,59.43 109.72,61.4 109.72,63.3 109.35,63.67 108.42,63.67 ; 115.07,59.35 117.72,61.99 ; 78.11,65.6 C31.1 80.18,65.52 C43.2 ; 65.82,70.35 64.96,69.69 64.96,65.94 65.29,65.6 C30.1 66.18,63.67 67.11,63.67 67.48,63.3 67.48,61.4 69.45,59.43 ; 72.83,59.35 75.48,61.99 C34.1 75.48,62.4 ; 86.91,59.35 89.56,61.99 ; 100.99,59.35 103.64,61.99
  Top Layer w1: P27.1 120.08,18.6 C12.1 126.52,20.1 P16.1
  Top Layer w1.2: 75.4,62.32 77.84,64.77 78.11,65.6 ; 65.82,70.35 66.17,70.7 ; 106.58,65.6 106.58,70.35 ; 92.12,65.6 92.12,70.35 ; 78.14,65.7 78.14,70.35 ; 103.64,62.4 103.89,62.4 106.58,65.09 ; 92.12,65.4 91.92,64.77 89.51,62.35
  Top Layer w1.3: D7.2 49.28,32.7 54.48,37.9 C13.1 ; 52.48,45.15 53.85,43.78 53.85,39.4
  Top Layer w1.6: 17.48,72.4 P17.1 17.48,65.03 DZ1.2
  Top Layer w2: NOREF#40.1 122.88,58.4 119.09,62.19 121.08,64.19 121.08,69.1 119.43,70.75 NOREF#47.0
  Bottom Layer w0.381: v1(15.15,70.47) 12.48,73.13 v1(12.48,74.98)
  Bottom Layer w1.2: 124.82,21.06 125.38,21.06
  Bottom Layer w1.6: P17.1 16.88,72.2 17.48,72.8
  Bottom Layer w2: 53.98,40.52 61.11,40.52 64.98,44.4 64.98,69.51 65.82,70.35 ; 65.82,70.35 65.82,70.23 ; 65.82,70.35 NOREF#47.0 65.82,71.77 62.58,75 19.68,75 17.48,72.8 P17.1 ; NOREF#40.1 122.88,23.56 125.38,21.06 P16.1 ; 16.88,72.2 v1(15.15,70.47) 9.16,64.48 P15#2.1
48V1: length 18.3
  Top Layer w0.3: C1.1 19.48,56.66 R4.2
  Top Layer w2: P15.1 18.78,41.84 C2.1
48V_IN: length 93.4
  Top Layer w0.3: v1(40.68,68.5) R21.1
  Top Layer w2: 33.38,68.9 P2.3 36.28,75.82 41.96,81.5 C20.1 ; 33.38,68.9 30.75,66.27 DZ2.2 ; 33.38,68.9 27.88,68.9 26.28,70.5 P2.1
  Bottom Layer w0.3: v1(40.68,68.5) 39.58,68.5 P2.3
  Bottom Layer w2: P2.3 15.75,51.26 15.75,43.48 10.15,37.88 P15.2
48V_SPN-: length 31.7
  Top Layer w0.3: Q1.2 58.72,70.64 D17.2 ; D15.2 42.76,70.42 41.68,71.5
  Top Layer w2: DZ2.1 37.62,68.03 41.4,71.82 ; C20.2 55.89,73.85 Q1.2
GND: length 130.3
  Top Layer w0.3: Q3.3 44.78,64 R57.2 42.88,65.5 DZ4.1 ; U8.3 70.58,56.5 U8.29 U8.18 ; v1(68.88,49.79) 69.68,49 69.68,47.6 70.45,46.83 C46.2 ; 92.08,34.2 92.88,34.2 93.23,34.55 U4.20 ; 92.08,34.2 91.73,34.55 U4.23 ; 92.08,34.2 93.38,32.9 94.48,32.9 v1(95.08,33.5) ; U6.1 42.07,30.11 40.98,31.2 39.18,31.2 38.91,30.93 C23.2 36.38,29.9 34.38,27.9 34.38,26.4 34.98,25.8 C54.2 C55.2 ; 74.96,28.4 v1(76.16,28.4) 76.16,28.33 R70.1 78.18,26.7 79.76,28.28 79.76,28.4 ; C61.1 88.08,22.46 P50.1 ; U11.18 U11.29 112.82,56.5 U11.3 ; 112.74,46.85 111.96,47.63 111.96,49.03 110.18,50.81 v1(110.18,53.3) ; C106.1 86.96,28.6 v1(87.88,28.6) 88.63,29.35 U4.35 ; 98.66,46.85 97.88,47.63 97.88,49.03 95.88,51.03 v1(95.88,53.4) ; 83.25,49.57 83.8,49.03 83.8,47.63 84.58,46.85 ; 83.25,49.57 83.01,49.82 ; 83.25,49.57 81.98,50.85 81.98,51.7 ; U4.47 96.23,26.15 96.68,25.7 97.98,25.7 ; 94.28,22.07 v1(94.28,23.3) ; U10.3 98.74,56.5 NOREF#8.5 U10.18 ; U9.18 NOREF#10.5 84.66,56.5 U9.3 ; v1(96.18,31.9) 96.63,32.35 U4.8 ; 97.98,25.7 v1(97.98,26.3) ; 97.98,25.7 99.38,25.7 101.38,23.7 103.58,23.7 104.18,23.1 104.18,22.07 104.06,22.07 102.48,20.5 R102.1 ; U16.3 111.63,20.55 111.18,21 111.18,22.9 110.68,23.4 C24.2 ; v1(82.48,23.3) 82.08,22.9 C62.1 ; 74.96,22.3 74.96,21.97 76.98,24 76.98,25.06 76.75,25.3 ; 81.98,51.7 v1(81.98,53.2) ; 81.98,51.7 81.98,51.9
  Top Layer w0.6: 14.23,58.18 D10.2 ; v1(20.75,19.4) 20.64,19.5 20.64,19.57 19.96,20.25 R100.1 ; v1(17.5,26.11) 16.69,26.11 C18.1 ; v1(17.12,20.4) 16.26,20.4 C19.1 ; v1(27.5,21.8) 26.75,21.8 26.72,21.82 26.67,21.82 26.47,22.02 R76.1 ; v1(27.55,20.35) 26.53,20.35 R75.2
  vias: v1(1.41,43.08) v1(1.41,42.28) v1(1.41,38.34) v1(1.41,37.54) v1(1.41,28.62) v1(1.41,27.82) v1(1.5,41.05) v1(1.5,40.25) v1(1.5,30.73) v1(1.5,29.93) v1(1.45,16.46) v1(1.45,15.66) v1(1.5,14.51) v1(1.5,13.71) v1(1.57,36.47) v1(1.57,35.67) v1(1.53,34.44) v1(1.53,33.64) v1(1.53,32.64) v1(1.53,31.84) v1(1.53,20.41) v1(1.53,19.61) v1(1.53,18.22) v1(1.53,17.42) v1(1.67,66.86) v1(1.73,44.88) v1(1.73,44.08) v1(1.88,70.3) v1(1.88,69.6) v1(2.21,43.08) v1(2.21,42.28) v1(2.21,38.34) v1(2.21,37.54) v1(2.21,28.62) v1(2.21,27.82) v1(2.3,41.05) v1(2.3,40.25) v1(2.3,30.73) v1(2.3,29.93) v1(2.25,16.46) v1(2.25,15.66) v1(2.3,14.51) v1(2.3,13.71) v1(2.37,66.86) v1(2.37,36.47) v1(2.37,35.67) v1(2.33,34.44) v1(2.33,33.64) v1(2.33,32.64) v1(2.33,31.84) v1(2.37,26.16) v1(2.37,25.36) v1(2.33,20.41) v1(2.33,19.61) v1(2.33,18.22) v1(2.33,17.42) v1(2.53,44.88) v1(2.53,44.08) v1(2.58,70.3) v1(2.58,69.6) v1(2.9,62.06) v1(3.01,43.08) v1(3.01,42.28) v1(3.01,38.34) v1(3.01,37.54) v1(3.01,28.62) v1(3.01,27.82) v1(3.07,66.86) v1(3.09,41.05) v1(3.09,40.25) v1(3.09,30.73) v1(3.09,29.93) v1(3.05,16.46) v1(3.05,15.66) v1(3.09,14.51) v1(3.09,13.71) v1(3.17,36.47) v1(3.17,35.67) v1(3.13,34.44) v1(3.13,33.64) v1(3.13,32.64) v1(3.13,31.84) v1(3.17,26.16) v1(3.17,25.36) v1(3.13,20.41) v1(3.13,19.61) v1(3.13,18.22) v1(3.13,17.42) v1(3.33,44.88) v1(3.33,44.08) v1(3.7,62.06) v1(3.81,43.08) v1(3.81,42.28) v1(3.81,38.34) v1(3.81,37.54) v1(3.81,28.62) v1(3.81,27.82) v1(3.89,41.05) v1(3.89,40.25) v1(3.89,30.73) v1(3.89,29.93) v1(3.85,16.46) v1(3.85,15.66) v1(3.89,14.51) v1(3.89,13.71) v1(3.97,36.47) v1(3.97,35.67) v1(3.93,34.44) v1(3.93,33.64) v1(3.93,32.64) v1(3.93,31.84) v1(3.97,26.16) v1(3.97,25.36) v1(3.93,20.41) v1(3.93,19.61) v1(3.93,18.22) v1(3.93,17.42) v1(4.13,44.88) v1(4.13,44.08) v1(4.5,62.06) v1(4.77,26.16) v1(4.77,25.36) v1(5.3,62.06) v1(5.36,45.11) v1(5.36,44.31) v1(6.16,45.11) v1(6.16,44.31) v1(6.91,26.2) v1(6.91,25.4) v1(6.96,45.11) v1(6.96,44.31) v1(7.71,26.2) v1(7.71,25.4) v1(7.76,45.11) v1(7.76,44.31) v1(8.51,26.2) v1(8.51,25.4) v1(9.31,26.2) v1(9.31,25.4) v1(10.18,30.5) v1(10.18,29.7) v1(10.7,26.52) v1(10.7,25.72) v1(10.98,30.5) v1(10.98,29.7) v1(11.5,26.52) v1(11.5,25.72) v1(11.78,30.5) v1(11.78,29.7) v1(11.9,28.19) v1(11.9,27.39) v1(12.3,26.52) v1(12.3,25.72) v1(12.58,30.5) v1(12.58,29.7) v1(12.7,28.19) v1(12.7,27.39) v1(13.1,26.52) v1(13.1,25.72) v1(13.5,28.19) v1(13.5,27.39) v1(14.3,28.19) v1(14.3,27.39) v1(25.09,77.81) v1(25.09,77.01) v1(25.89,77.81) v1(25.89,77.01) v1(26.69,77.81) v1(26.69,77.01) v1(27.49,77.81) v1(27.49,77.01) v1(27.58,42.7) v1(27.68,41.9) v1(28.38,42.7) v1(28.48,41.9) v1(29.18,42.7) v1(29.28,41.9) v1(29.4,72.31) v1(29.87,72.96) v1(29.83,17.12) v1(29.83,16.32) v1(29.98,42.7) v1(30.08,41.9) v1(30.29,77.81) v1(30.29,77.01) v1(30.55,24.6) v1(30.55,23.8) v1(30.63,17.12) v1(30.63,16.32) v1(30.78,58.1) v1(30.78,57.3) v1(30.78,56.5) v1(30.78,53.4) v1(30.78,52.6) v1(30.77,51.81) v1(30.77,51.01) v1(30.77,50.21) v1(31.09,77.81) v1(31.09,77.01) v1(31.35,24.6) v1(31.35,23.8) v1(31.43,17.12) v1(31.43,16.32) v1(31.58,58.1) v1(31.58,57.3) v1(31.58,56.5) v1(31.58,53.4) v1(31.58,52.6) v1(31.57,51.81) v1(31.57,51.01) v1(31.57,50.21) v1(31.89,77.81) v1(31.89,77.01) v1(32.15,24.6) v1(32.15,23.8) v1(32.23,17.12) v1(32.23,16.32) v1(32.69,77.81) v1(32.69,77.01) v1(32.68,72.83) v1(32.94,72.16) v1(32.95,24.6) v1(32.95,23.8) v1(33.85,24.4) v1(34.55,24.14) v1(34.8,24.72) v1(35.28,48.6) v1(35.28,47.8) v1(36.08,48.6) v1(36.08,47.8) v1(36.13,16.24) v1(36.13,15.44) v1(36.88,48.6) v1(36.88,47.8) v1(36.93,16.24) v1(36.93,15.44) v1(37.68,48.6) v1(37.68,47.8) v1(37.73,16.24) v1(37.73,15.44) v1(38.48,48.6) v1(38.48,47.8) v1(38.53,16.24) v1(38.53,15.44) v1(39.28,48.6) v1(39.28,47.8) v1(40.08,48.6) v1(40.08,47.8) v1(40.38,40.6) v1(40.38,39.8) v1(40.38,39) v1(40.38,36.2) v1(40.38,35.4) v1(40.38,34.6) v1(40.88,48.6) v1(40.88,47.8) v1(41.18,40.6) v1(41.18,39.8) v1(41.18,39) v1(41.18,36.2) v1(41.18,35.4) v1(41.18,34.6) v1(41.68,48.6) v1(41.68,47.8) v1(42.26,30.94) v1(43.11,78.39) v1(43.21,30.9) v1(43.43,77.21) v1(43.48,39.1) v1(43.48,38.3) v1(43.91,78.39) v1(44.23,77.21) v1(44.18,66.2) v1(44.18,65.4) v1(44.17,30.78) v1(44.28,39.1) v1(44.28,38.3) v1(44.55,30.13) v1(44.71,78.39) v1(45.03,77.21) v1(44.98,66.2) v1(44.98,65.4) v1(45.08,39.1) v1(45.08,38.3) v1(45.51,78.39) v1(45.83,77.21) v1(45.78,66.2) v1(45.78,65.4) v1(45.88,39.1) v1(45.88,38.3) v1(46.58,66.2) v1(46.58,65.4) v1(46.68,39.1) v1(46.68,38.3) v1(53.25,34.37) v1(54.12,34.94) v1(54.14,25.92) v1(54.39,35.68) v1(54.49,26.59) v1(54.67,31.89) v1(54.72,24.29) v1(54.74,25.92) v1(54.92,35.26) v1(55.16,35.95) v1(55.5,31.79) v1(55.85,35.12) v1(56.89,35.36) v1(57.05,36.13) v1(57.51,35.64) v1(58.38,73.4) v1(58.38,72.6) v1(58.43,35.52) v1(59.18,73.4) v1(59.18,72.6) v1(59.98,73.4) v1(59.98,72.6) v1(60.68,71.6) v1(60.68,70.8) v1(60.68,70) v1(60.78,73.4) v1(60.78,72.6) v1(61,79.71) v1(61,78.59) v1(61.08,77.64) v1(61.48,71.6) v1(61.48,70.8) v1(61.48,70) v1(61.8,79.71) v1(61.8,78.59) v1(61.88,77.64) v1(62.6,79.71) v1(62.6,78.59) v1(62.68,77.64) v1(62.92,38.73) v1(63.08,65) v1(63.4,79.71) v1(63.4,78.59) v1(63.48,77.64) v1(63.68,40.5) v1(63.68,39.7) v1(63.68,38.9) v1(63.97,34.32) v1(64.25,33.52) v1(64.48,40.5) v1(64.48,39.7) v1(64.48,38.9) v1(64.48,38.1) v1(64.63,34.1) v1(65.36,23.37) v1(65.68,40.5) v1(65.68,39.7) v1(65.68,38.9) v1(65.68,38.1) v1(66.03,23.23) v1(66.48,40.5) v1(66.48,39.7) v1(66.48,38.9) v1(66.48,38.1) v1(66.61,31.57) v1(66.7,23.22) v1(67.3,68.56) v1(67.33,31.66) v1(67.39,22.31) v1(67.35,21.53) v1(67.5,23.06) v1(67.85,52.94) v1(67.85,52.14) v1(67.85,51.34) v1(67.96,26.02) v1(68.04,31.68) v1(68.11,23.45) v1(68.43,32.31) v1(68.6,25.98) v1(68.64,31.58) v1(68.9,23.52) v1(69.19,32.27) v1(69.27,31.52) v1(69.31,26.13) v1(69.27,25.36) v1(69.34,21.76) v1(69.52,24.72) v1(69.52,23.08) v1(69.73,22.4) v1(69.81,32.11) v1(69.89,31.33) v1(69.97,25.87) v1(70.02,21.62) v1(70.34,23) v1(70.52,31.36) v1(70.51,22.13) v1(70.69,25.8) v1(71.9,68.6) v1(71.89,67.84) v1(75.08,45.41) v1(75.38,39.4) v1(75.38,38.6) v1(75.56,59.09) v1(75.69,58.38) v1(76.18,39.4) v1(76.18,38.6) v1(76.36,59.09) v1(76.48,69.04) v1(76.49,58.38) v1(76.7,68.45) v1(76.7,67.65) v1(76.7,66.85) v1(76.7,66.05) v1(76.68,65.3) v1(76.98,39.4) v1(76.98,38.6) v1(77.16,59.09) v1(77.28,59.81) v1(77.29,58.38) v1(77.45,60.75) v1(78.08,59.81) v1(78.04,59.05) v1(78.16,58.2) v1(78.25,60.75) v1(78.48,74.93) v1(78.48,74.13) v1(78.48,73.33) v1(78.48,72.53) v1(78.72,12.18) v1(78.88,59.81) v1(78.84,59.05) v1(78.96,58.2) v1(79.05,60.75) v1(79.52,68.57) v1(79.52,12.18) v1(79.64,59.05) v1(79.76,58.2) v1(80.32,12.18) v1(81.19,68.51) v1(81.15,22) v1(85.48,45.5) v1(85.98,68.97) v1(85.99,68.17) v1(88.37,13.66) v1(88.48,14.73) v1(88.58,15.68) v1(89.17,13.66) v1(89.28,14.73) v1(89.38,15.68) v1(89.88,58.51) v1(89.88,57.71) v1(89.88,56.91) v1(89.98,65.29) v1(89.97,13.66) v1(90.08,14.73) v1(90.17,15.68) v1(90.48,47.1) v1(90.72,56.7) v1(90.78,68.45) v1(90.78,67.65) v1(90.78,66.85) v1(90.78,66.05) v1(90.76,65.3) v1(90.75,57.94) v1(90.74,55.53) v1(90.86,59.16) v1(91,57.29) v1(91.02,54.93) v1(91.09,56.08) v1(91.04,54.22) v1(91.18,74.98) v1(91.18,74.18) v1(91.18,73.38) v1(91.18,72.58) v1(91.18,58.56) v1(91.48,59.8) v1(91.52,56.7) v1(91.55,57.94) v1(91.54,55.53) v1(91.66,59.16) v1(91.8,57.29) v1(91.82,54.93) v1(91.89,56.08) v1(91.84,54.22) v1(91.98,58.56) v1(92.28,59.8) v1(92.32,56.7) v1(92.35,57.94) v1(92.34,55.53) v1(92.46,59.16) v1(92.6,57.29) v1(92.62,54.93) v1(92.69,56.08) v1(92.64,54.22) v1(92.78,58.56) v1(93.08,59.8) v1(93.74,58.99) v1(93.74,58.19) v1(93.74,57.39) v1(94.38,68.55) v1(95.18,15.59) v1(95.35,14.92) v1(95.98,15.59) v1(96.15,14.92) v1(96.81,68.59) v1(96.78,15.59) v1(96.95,14.92) v1(99.28,15.5) v1(100.47,68.25) v1(100.92,68.88) v1(100.93,67.64) v1(101.38,68.39) v1(103.51,57.31) v1(103.63,59.91) v1(103.59,59.18) v1(103.69,58.54) v1(103.69,46.35) v1(103.82,56.56) v1(103.89,47.17) v1(104.06,65.29) v1(104.16,57.83) v1(104.39,59.18) v1(104.48,60.01) v1(104.49,58.54) v1(104.86,68.45) v1(104.86,67.65) v1(104.86,66.85) v1(104.86,66.05) v1(104.84,65.3) v1(105.19,59.18) v1(105.29,58.54) v1(105.58,59.8) v1(106,59.14) v1(106.1,58.48) v1(106.05,53.43) v1(106.38,59.8) v1(106.56,47.6) v1(106.75,52.94) v1(106.9,58.48) v1(107.18,59.8) v1(107.18,25.9) v1(107.18,25.1) v1(107.18,24.3) v1(107.18,23.5) v1(107.35,59.18) v1(107.7,58.48) v1(107.79,60.18) v1(107.98,25.9) v1(107.98,25.1) v1(107.98,24.3) v1(107.98,23.5) v1(108.15,59.18) v1(108.35,68.56) v1(108.42,56.96) v1(109.8,16.1) v1(109.83,16.83) v1(110.6,16.1) v1(110.63,16.83) v1(111.4,16.1) v1(111.43,16.83) v1(117.34,65.29) v1(118.14,65.29) v1(118.58,58.85) v1(118.58,58.05) v1(118.58,57.25) v1(118.58,56.45) v1(118.92,65.3) v1(118.94,68.45) v1(118.94,67.65) v1(118.94,66.85) v1(118.94,66.05) v1(119.05,55.81) v1(119.14,55.07) v1(119.25,54.3) v1(119.38,58.85) v1(119.38,58.05) v1(119.38,57.25) v1(119.38,56.45) v1(119.37,53.58) v1(119.48,47.5) v1(119.85,55.81) v1(119.94,55.07) v1(120.05,54.3) v1(120.18,58.85) v1(120.18,58.05) v1(120.18,57.25) v1(120.18,56.45) v1(120.17,53.58) v1(120.65,55.81) v1(120.74,55.07) v1(120.85,54.3) v1(120.97,53.58) v1(124.71,24.53) v1(124.77,27.49) v1(125.51,24.53) v1(125.57,27.49) v1(125.74,62.38) v1(126.06,64.43) v1(126.31,24.53) v1(126.38,63.7) v1(126.37,27.49) v1(126.52,29.59) v1(126.54,62.38) v1(126.66,40.41) v1(126.86,64.43) v1(126.84,48.28) v1(127,61.79) v1(126.93,47.61) v1(127.18,63.7) v1(127.32,29.59) v1(127.34,62.38) v1(127.46,40.41) v1(127.66,64.43) v1(127.64,48.28) v1(127.8,61.79) v1(127.73,47.61) v1(127.98,63.7) v1(128.12,29.59) v1(128.26,40.41) v1(128.44,48.28) v1(128.6,61.79) v1(128.53,47.61) v2(74.9,16.3) v2(74.9,15.7) v2(89.58,37.8) v2(108.58,36.63) v2(108.55,34.7)
VCC: length 377.6
  Top Layer w0.3: 101.74,54.4 101.74,51.64 102.78,50.6 v1(102.78,49.9) ; v1(68.08,34.1) 67.98,34.2 67.98,44.2 ; R47.1 100.78,46.03 102.31,44.5 ; R45.1 v1(74.08,45.4) 75.58,43.9 R37.2 76.68,42.7 77.74,41.64 86.46,41.64 J7.1 ; 87.66,54.4 87.66,51.62 88.28,51 v1(88.28,50) ; 97.23,42.8 102.21,42.8 102.31,42.7 J9.1 ; 97.23,42.8 93.71,42.8 93.1,42.19 91.5,42.19 90.75,42.93 90.75,43.9 ; 97.23,42.8 J9.3 ; 114.92,44.84 114.88,44.88 R48.1 ; 114.92,44.84 116.36,43.4 116.86,43.9 118.88,43.9 ; 114.92,44.84 112.02,44.84 111.48,44.3 J6.3 111.48,42.68 110.61,41.8 105.58,41.8 104.82,42.57 R39.2 102.91,43.9 102.31,44.5 ; R46.1 86.78,46.6 88.22,45.16 J7.1 ; 102.31,44.5 102.04,44.5 ; 102.31,44.5 102.31,42.98 ; J6.1 114.86,41.7 112.68,41.7 109.58,38.6 R52.1 ; 90.75,43.9 90.78,43.87 ; 90.75,43.9 88.72,43.9 J7.1 ; 73.58,54.4 73.58,51.7 74.18,51.1 v1(74.18,50) ; 115.82,54.4 115.82,51.56 116.68,50.7 v1(116.68,49.9) ; v3(60.28,21.72) 60.03,21.97 C9.2 55.66,23.05 55.66,30.05 55.22,30.49 C3.2 53.32,31.61 50.99,31.61 49.49,30.11 U6.16 ; U16.5 115.03,22.45 114.48,21.9 114.48,19.6 112.98,18.1 112.98,12.9 110.58,10.5 103.08,10.5 102.48,11.1 102.48,16.8 101.58,17.7 79.98,17.7 P18.2 ; 67.98,44.2 65.98,44.2 63.98,46.2 63.98,60.7 63.48,61.2 61.63,61.2 U15.5 61.23,62.05 62.18,63 62.18,64.5 61.58,65.1 58.58,65.1 R81.2 ; 67.98,44.2 v1(72.38,44.2) ; 109.58,37.7 109.68,37.8 ; 83.14,41.66 J7.3
  Top Layer w0.6: P12.3 P11.3 P8.3 P7.3 P4.3 P3.3 ; v1(37.18,20.2) 32.15,20.2 27.65,24.7 16.82,24.7 C18.2 14.91,24.43 D9.2
  Top Layer w0.8: U5.3 73.28,34.1 v3(72.48,34.1) 70.98,35.6
  Top Layer w0.9: 59.8,23.78 62.06,26.03 62.06,27.05 63.07,28.07 U7.3 ; 59.8,23.78 L3.1 ; 59.8,23.78 60.82,23.78 ; v3(62.95,24.38) 62.34,23.78 60.82,23.78 ; v3(60.28,21.72) 62.37,21.72 C8.1 60.82,23.78
  Bottom Layer w0.3: v1(72.38,44.2) 72.88,44.2 v1(74.08,45.4) ; 74.18,45.5 v1(74.18,50) ; J7.1 88.26,43.44 88.26,50 ; J6.1 116.68,43.52 v1(116.68,49.9) ; J9.3 J8.3 ; J8.1 102.31,49.43 v1(102.78,49.9) ; 116.36,43.4 116.42,43.46
  Bottom Layer w0.6: P12.3 77.14,17.74 P18.2 P18.1 ; P6.3 25.27,15.34 v1(31.13,21.2) ; v1(37.18,20.2) 39.64,17.74 P3.3
  Bottom Layer w0.8: v3(72.48,34.1) v1(68.08,34.1) 67.08,34.1 62.95,29.97 v3(62.95,24.38)
  Bottom Layer w0.9: P7.3 53.32,17.74 54.88,19.31 57.87,19.31 v3(60.28,21.72)
(no net):
  vias: v1(66.86,30.12) v1(66.85,29.49) v1(66.86,28.88) v1(66.83,28.2) v1(66.84,27.44) v1(67.5,30.12) v1(67.49,29.49) v1(67.5,28.88) v1(67.47,28.2) v1(67.48,27.44) v1(68.12,29.49) v1(68.11,28.2) v1(68.12,27.44) v1(68.14,30.12) v1(68.14,28.88) v1(68.77,30.12) v1(68.76,29.49) v1(68.77,28.88) v1(68.75,28.2) v1(68.75,27.44)
BOOT0: length 10.4
  Top Layer w0.3: R102.2 99.18,25.1 95.58,25.1 94.73,25.95 U4.44
EXIO: length 16.7
  Top Layer w0.3: R91.1 106.28,23.3 v1(104.98,24.6) ; U4.46 v1(95.73,29.65)
  Bottom Layer w0.3: v1(95.73,29.65) 98.83,29.65 103.88,24.6 v1(104.98,24.6)
HOLD: length 9.7
  Top Layer w0.3: R65.1 87.68,23.7 88.48,23.7 89.08,24.3 89.08,25.6 89.38,25.9 91.93,25.9 92.23,26.2 U4.39
IN24V: length 11.7
  Top Layer w2: P15#2.2 9.16,60.52 11.77,57.91 11.77,53.35 P1.1
MOTOR_EN: length 120.8
  Top Layer w0.3: 107.48,47.4 107.48,47.7 ; 107.48,47.7 107.48,47.3 107.88,46.9 v1(107.88,44.62) ; 107.48,47.7 107.48,54.6 109.88,57 U11.2 ; R103.1 93.18,38.4 v1(93.88,37.7) ; v1(79.78,44.8) 79.78,46.8 79.38,47.2 79.38,54.5 81.88,57 U9.2 ; 67.48,57 66.88,57 65.18,55.3 65.18,46.9 66.48,45.6 72.88,45.6 77.58,40.9 v1(79.38,40.9) v2(93.28,40.9) 93.58,40.9 94.08,40.4 107.08,40.4 v1(107.58,40.9) ; 67.48,57 67.28,57 ; 67.48,57 U8.2 ; U10.2 95.08,57 93.38,55.3 93.38,47.3 93.88,46.8 v1(93.88,45.97) ; U4.18 94.23,37.25 93.83,37.65
  Bottom Layer w0.3: v1(107.88,44.62) 107.58,44.32 v1(107.58,40.9) ; v1(79.78,44.8) 79.38,44.4 v1(79.38,40.9) ; v1(93.88,37.7) 93.28,38.3 v2(93.28,40.9) 93.28,45.37 v1(93.88,45.97)
MS1: length 87.8
  Top Layer w0.3: P30.1 118.08,37.76 118.08,35.4 114.28,31.6 R49.1 ; U11.9 112.32,52.9 v1(111.72,52.3) ; v1(97.64,52.3) 98.24,52.9 U10.9 ; U8.9 70.08,52.9 v1(69.48,52.3) ; U9.9 84.16,52.9 v1(83.56,52.3)
  Bottom Layer w0.3: P30.1 121.78,41.46 121.78,51.7 120.78,52.7 114.68,52.7 114.28,52.3 v1(111.72,52.3) 106.08,52.3 104.98,53.4 100.58,53.4 99.48,52.3 v1(97.64,52.3) 95.28,52.3 94.28,53.3 87.28,53.3 86.28,52.3 v1(83.56,52.3) 79.28,52.3 77.98,53.6 73.38,53.6 72.08,52.3 v1(69.48,52.3)
MS2: length 86.3
  Top Layer w0.3: R50.1 113.48,33.7 115.58,35.8 115.58,37.8 P30.3 ; U9.10 84.66,52 v1(84.26,51.6) ; v1(70.18,51.6) 70.58,52 U8.10 ; v1(112.42,51.6) 112.82,52 U11.10 ; U10.10 98.74,52 v1(98.34,51.6)
  Bottom Layer w0.3: P30.3 121.18,43.4 121.18,51.4 120.48,52.1 114.98,52.1 114.48,51.6 v1(112.42,51.6) 106.01,51.6 104.71,52.9 100.94,52.9 99.64,51.6 v1(98.34,51.6) 95.18,51.6 93.98,52.8 87.58,52.8 86.38,51.6 v1(84.26,51.6) 79.18,51.6 77.68,53.1 73.78,53.1 72.28,51.6 v1(70.18,51.6)
MS3: length 85.4
  Top Layer w0.3: U10.11 99.24,51.1 v1(99.04,50.9) ; v1(70.88,50.9) 71.08,51.1 U8.11 ; U9.11 85.16,51.1 v1(84.96,50.9) ; U11.11 113.32,51.1 v1(113.12,50.9) ; P30.5 114.34,38.96 R51.1
  Bottom Layer w0.3: v1(70.88,50.9) 72.38,50.9 74.08,52.6 77.28,52.6 78.98,50.9 v1(84.96,50.9) 86.48,50.9 87.88,52.3 93.58,52.3 94.98,50.9 v1(99.04,50.9) 99.78,50.9 101.28,52.4 104.42,52.4 105.92,50.9 v1(113.12,50.9) 114.68,50.9 115.38,51.6 120.18,51.6 120.58,51.2 120.58,43.7 117.58,40.7 115.18,40.7 114.34,39.86 P30.5
MX_1A: length 19.6
  Top Layer w0.3: U8.24 v1(71.58,60.9)
  Bottom Layer w0.8: v1(71.58,60.9) 71.58,60.2 71.08,59.7 69.78,59.7 69.08,60.4 69.08,70.5 70.1,71.52 P19.3
MX_1B: length 29.8
  Top Layer w0.3: 74.38,57.7 74.18,57.5 U8.21
  Top Layer w0.6: 74.39,57.81 NOREF#36.3
  Bottom Layer w0.8: P19.4 67.56,74.48 68.38,75.3 76.48,75.3 76.88,74.9 76.88,71.4 74.39,68.91 NOREF#36.3
MX_2A: length 15.9
  Top Layer w0.3: U8.26 v1(70.58,60.9)
  Bottom Layer w0.8: P19.2 72.64,72.06 70.58,70 v1(70.58,60.9)
MX_2B: length 21.8
  Top Layer w0.3: U8.1 68.18,57.5 67.83,57.85
  Top Layer w0.6: 67.83,57.85 NOREF#32.0
  Bottom Layer w0.8: NOREF#32.0 71.58,58.3 72.86,59.58 72.86,69.98 75.18,72.3 P19.1
MX_DIR: length 37.5
  Top Layer w0.3: v1(76.08,50.8) 76.08,54.6 ; 76.08,54.6 74.18,56.5 U8.19 ; 76.08,54.6 76.08,54 ; v1(81.38,40.2) 82.06,39.52 93.16,39.52 94.73,37.95 U4.17
  Bottom Layer w0.3: v1(81.38,40.2) 80.6,40.98 J7.4 80.6,47.38 77.18,50.8 v1(76.08,50.8)
